# EAGLE design 3-Displays (EAGLE 7.2.0)
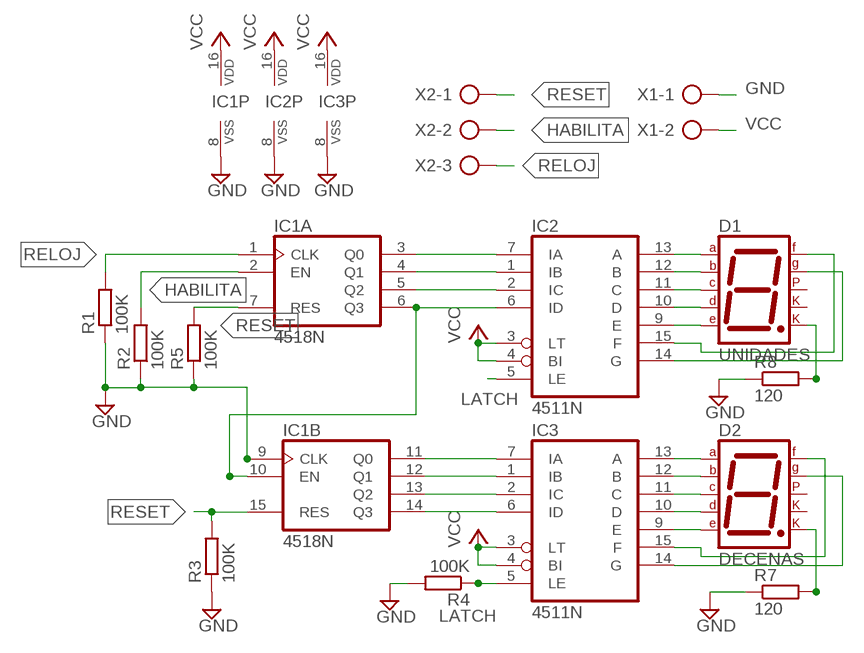
[diagram p0: schematic, sheet 1]

## Parts
D1  UNIDADES  7SEG-CK  [7SEG-13]
D2  DECENAS  7SEG-CK  [7SEG-13]
IC1  4518N  [DIL16]
IC2  4511N  [DIL16]
IC3  4511N  [DIL16]
R1  100K  R-EU_0207/7  [0207/7]
R2  100K  R-EU_0207/7  [0207/7]
R3  100K  R-EU_0207/7  [0207/7]
R4  100K  R-EU_0207/7  [0207/7]
R5  100K  R-EU_0207/7  [0207/7]
R7  120  R-EU_0207/7  [0207/7]
R8  120  R-EU_0207/7  [0207/7]
X1  AK500/2-H  [AK500/2-H]
X2  AK500/3-H  [AK500/3-H]

## Nets
GND: IC1.8(P:VSS) IC1.9(B:CLK) IC2.8(VSS) IC3.8(VSS) R1.1 R2.1 R3.1 R4.2 R5.1 R7.1 R8.1 X1.1
HABILITA: IC1.2(A:EN) R2.2 X2.2
LATCH: IC2.5(LE) IC3.5(LE) R4.1
N$1: IC1.3(A:Q0) IC2.7(IA)
N$2: IC1.4(A:Q1) IC2.1(IB)
N$3: IC1.5(A:Q2) IC2.2(IC)
N$4: D1.8(CK2) R8.2
N$5: D2.7(A) IC3.13(A)
N$6: D2.6(B) IC3.12(B)
N$7: D2.4(C) IC3.11(C)
N$8: D2.2(D) IC3.10(D)
N$9: D2.1(E) IC3.9(E)
N$10: IC1.11(B:Q0) IC3.7(IA)
N$11: IC1.12(B:Q1) IC3.1(IB)
N$12: IC1.14(B:Q3) IC3.6(ID)
N$13: IC1.13(B:Q2) IC3.2(IC)
N$14: D2.9(F) IC3.15(F)
N$15: D2.10(G) IC3.14(G)
N$16: D2.8(CK2) R7.2
N$18: D1.7(A) IC2.13(A)
N$19: D1.6(B) IC2.12(B)
N$20: D1.4(C) IC2.11(C)
N$21: D1.2(D) IC2.10(D)
N$22: D1.1(E) IC2.9(E)
N$23: D1.9(F) IC2.15(F)
N$24: D1.10(G) IC2.14(G)
N$26: IC1.6(A:Q3) IC1.10(B:EN) IC2.6(ID)
RELOJ: IC1.1(A:CLK) R1.2 X2.3
RESET: IC1.7(A:RES) IC1.15(B:RES) R3.2 R5.2 X2.1
VCC: IC1.16(P:VDD) IC2.3(LT) IC2.4(BI) IC2.16(VDD) IC3.3(LT) IC3.4(BI) IC3.16(VDD) X1.2
Unconnected: D1.3(CK1) D1.5(DP) D2.3(CK1) D2.5(DP)

## Library data of the parts
D1 D2 = special:7SEG-CK: 7-segment DISPLAY single cathode, 13 mm
IC1 = 45xx:4518: Dual BCD up COUNTER
IC2 IC3 = 45xx:4511: BCD to 7-segment LATCH/DECODER/DRIVER
R1-R5 R7 R8 = resistor:R-EU_: RESISTOR, European symbol
X1 = con-ptr500:AK500/2-H: CONNECTOR Aug. 2004 / PTR Meßtechnik: Die Bezeichnung der Serie AK505 wurde geändert. Es handelt sich hierbei um AK500 in horizontaler Ausführung.; OC_FARNELL: unknown; OC_NEWARK: unknown
X2 = con-ptr500:AK500/3-H: CONNECTOR Aug. 2004 / PTR Meßtechnik: Die Bezeichnung der Serie AK505 wurde geändert. Es handelt sich hierbei um AK500 in horizontaler Ausführung.; OC_FARNELL: unknown; OC_NEWARK: unknown

## Board
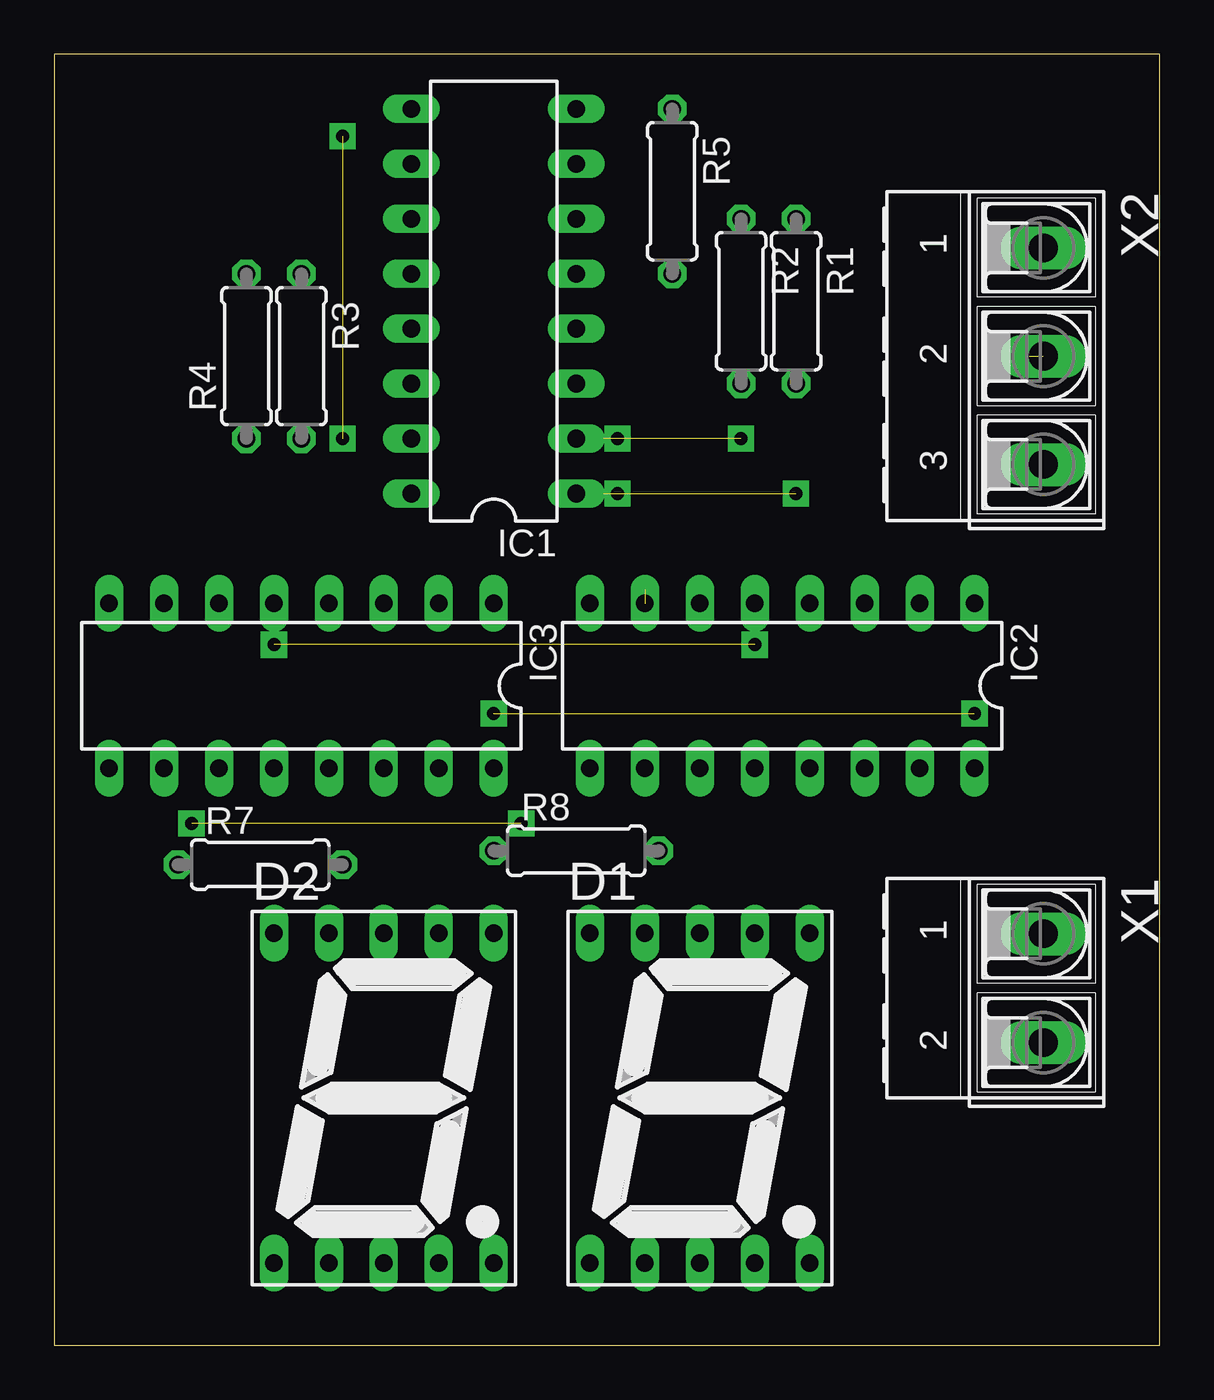
[diagram p1: board, top side]
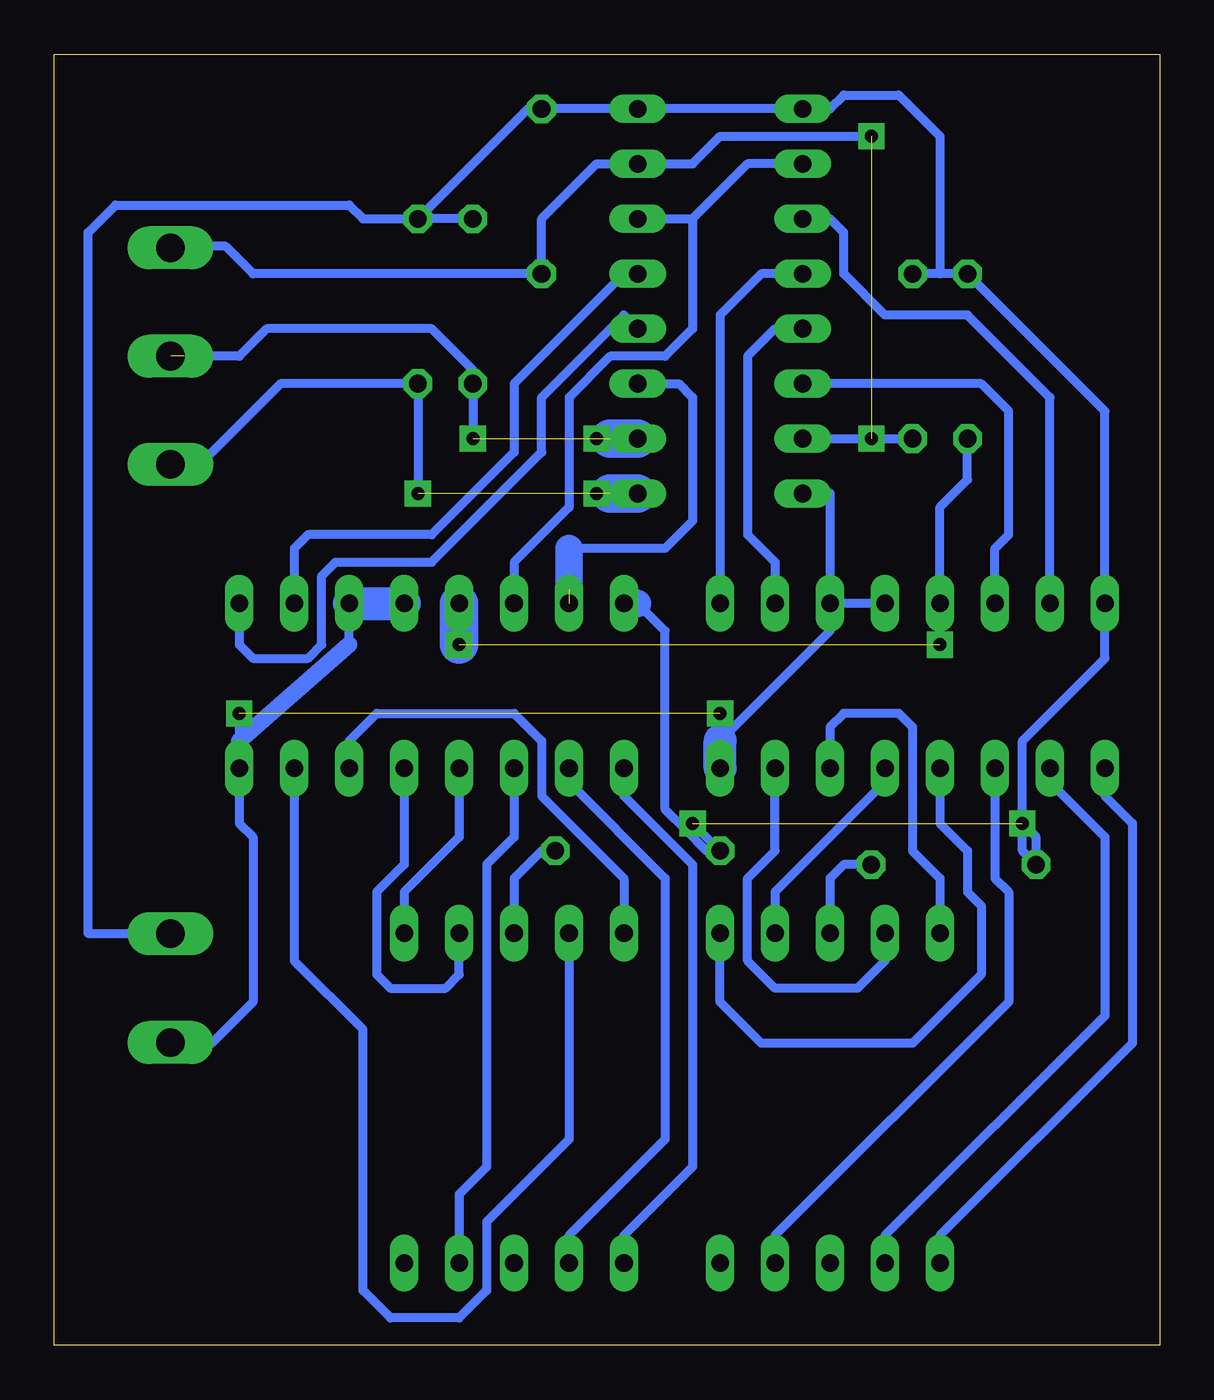
[diagram p2: board, bottom side, seen from below]

Size 51.1 x 59.68 mm. Coordinates in mm from the lower left corner, seen from the top.
Outline: 0,0 51.1,0 51.1,59.68 0,59.68 0,0
Copper layers (1*16): Top 0.035mm / dielectric 1.5mm / Bottom 0.035mm
Design rules "default *": minimum track width 10mil, minimum drill 24mil, track to track 8mil, track to pad 8mil, pad to pad 8mil, via to via 8mil, smd to smd 8mil, copper to edge 40mil, drill to drill 8mil, minimum pad ring 10mil, minimum via ring 12mil, stop-mask expansion 4mil, vias tented up to drill 0mil, thermal gap 10mil

### Footprints (pad centres in the part's own frame; a part is rotated, then mirrored left to right if it is on the bottom)
7SEG-13 = drill 0.813 long: 1 -5.08,-7.62; 2 -2.54,-7.62; 3 0,-7.62; 4 2.54,-7.62; 5 5.08,-7.62; 6 5.08,7.62; 7 2.54,7.62; 8 0,7.62; 9 -2.54,7.62; 10 -5.08,7.62
DIL16 = drill 0.813 long: 1 -8.89,-3.81; 2 -6.35,-3.81; 3 -3.81,-3.81; 4 -1.27,-3.81; 5 1.27,-3.81; 6 3.81,-3.81; 7 6.35,-3.81; 8 8.89,-3.81; 9 8.89,3.81; 10 6.35,3.81; 11 3.81,3.81; 12 1.27,3.81; 13 -1.27,3.81; 14 -3.81,3.81; 15 -6.35,3.81; 16 -8.89,3.81
0207/7 = drill 0.813 octagon: 1 -3.81,0; 2 3.81,0
AK500/2-H = drill 1.321 long: 1 -2.515,0; 2 2.515,0
AK500/3-H = drill 1.321 long: 1 -5.004,0; 2 0,0; 3 5.004,0

### Placement (x,y rotation side)
D1  29.84,11.43 0 top
D2  15.24,11.43 0 top
IC1  20.32,48.26 90 top
IC2  33.65,30.48 180 top
IC3  11.43,30.48 180 top
R1  34.29,48.26 270 top
R2  31.75,48.26 270 top
R3  11.43,45.72 270 top
R4  8.89,45.72 90 top
R5  28.57,53.34 270 top
R7  9.53,22.23 0 top
R8  24.13,22.86 0 top
X1  45.72,16.51 270 top
X2  45.72,45.72 270 top

### Tracks (layer width: path | path; a pad name or v marks a point on that pad's centre or on a via)
GND  (via drill 0.6)  (1 unrouted)
  Bottom 0.406: v6.35,24.13 5.71,23.5 R7.1 6.35,22.86 v6.35,24.13 | v6.35,24.13 6.35,27.94 2.54,31.75 IC3.8 2.54,43.18 R4.2 10.16,49.53 | R2.1 R1.1 | 21.91,23.81 20.96,22.86 R8.1 21.59,24.13 21.91,23.81 | 21.91,23.81 22.86,24.77 22.86,33.02 24.13,34.29 | 10.16,49.53 R3.1 | IC1.9 IC1.8 R5.1 | R5.1 29.21,57.15 R1.1 | IC1.9 R5.1 | X1.1 49.5,19.03 49.53,19.05 49.53,51.43 48.26,52.7 37.46,52.7 36.83,52.07 R1.1 | IC1.9 15.24,57.15 14.61,57.78 12.07,57.78 10.16,55.88 10.16,49.53
  Bottom 1.27: 24.13,34.29 IC2.8
HABILITA  (2 unrouted)
  Bottom 0.406: 45.08,45.72 42.54,45.72 41.27,46.99 33.65,46.99 31.75,45.08 R2.2 31.75,41.91
  Bottom 1.778: IC1.2 25.4,41.91
LATCH  (via drill 0.6)  (1 unrouted)
  Bottom 0.406: R4.1 8.89,40 10.16,38.73 IC3.5 v10.16,32.38
  Bottom 1.778: IC2.5 v32.38,32.38
N$1  (1 unrouted)
  Bottom 0.406: IC1.3 22.23,44.45 21.59,43.81 21.59,38.1 22.86,36.83 27.3,36.83
  Bottom 1.27: 27.3,36.83 27.3,34.92
N$2
  Bottom 0.406: IC2.1 42.54,32.38 41.91,31.75 39.37,31.75 38.73,32.38 38.73,35.56 38.1,36.2 33.65,36.2 28.57,41.27 28.57,43.81 24.77,47.62 IC1.4
N$3
  Bottom 0.406: IC1.5 24.77,49.53 29.84,44.45 29.84,41.27 33.65,37.46 39.37,37.46 40,36.83 IC2.2
N$4
  Bottom 0.406: R8.2 28.57,22.86 29.84,21.59 D1.8
N$5
  Bottom 0.406: IC3.13 12.7,26.04 17.78,20.96 D2.7
N$6
  Bottom 0.406: IC3.12 10.16,24.13 8.89,22.86 8.89,20.96 8.26,20.32 8.26,17.14 11.43,13.97 18.41,13.97 20.32,15.88 D2.6
N$7
  Bottom 0.406: D2.4 17.78,5.08 6.99,15.88 6.99,20.96 7.62,21.59 IC3.11
N$8
  Bottom 0.406: IC3.10 5.08,26.04 2.54,23.5 2.54,15.24 12.7,5.08 D2.2
N$9
  Bottom 0.406: IC3.9 2.54,25.4 1.27,24.13 1.27,13.97 10.16,5.08 D2.1
N$10
  Bottom 0.406: IC3.7 5.08,43.81 8.89,47.62 12.7,47.62 14.61,49.53 14.61,51.43 15.24,52.07 IC1.11
N$11
  Bottom 0.406: IC1.12 18.41,49.53 20.32,47.62 IC3.1
N$12
  Bottom 0.406: IC3.6 7.62,36.83 6.99,37.46 6.99,43.18 8.26,44.45 IC1.14
N$13
  Bottom 0.406: IC1.13 17.78,46.99 19.05,45.72 19.05,37.46 17.78,36.2 IC3.2
N$14
  Bottom 0.406: D2.9 12.7,17.78 13.97,16.51 17.78,16.51 19.05,17.78 19.05,21.59 17.78,22.86 IC3.15
N$15
  Bottom 0.406: IC3.14 15.24,28.57 14.61,29.21 12.07,29.21 11.43,28.57 11.43,22.86 10.16,21.59 D2.10
N$16
  Bottom 0.406: R7.2 14.61,22.23 15.24,21.59 D2.8
N$17  (via drill 0.6)
  other vias: 26.04,41.91
N$18
  Bottom 0.406: IC2.13 34.92,22.23 36.2,20.96 36.2,17.14 35.56,16.51 33.02,16.51 32.38,17.14 D1.7
N$19
  Bottom 0.406: IC2.12 32.38,23.5 34.92,20.96 D1.6
N$20
  Bottom 0.406: IC2.11 29.84,23.5 31.11,22.23 31.11,8.26 32.38,6.99 D1.4
N$21
  Bottom 0.406: IC2.10 27.3,26.04 22.86,21.59 22.86,9.53 27.3,5.08 D1.2
N$22
  Bottom 0.406: IC2.9 24.77,25.4 21.59,22.23 21.59,8.26 24.77,5.08 D1.1
N$23
  Bottom 0.406: IC2.15 40,17.78 36.83,14.61 36.83,2.54 35.56,1.27 32.38,1.27 31.11,2.54 31.11,5.71 27.3,9.53 D1.9
N$24
  Bottom 0.406: IC2.14 37.46,27.94 36.2,29.21 29.84,29.21 28.57,27.94 28.57,25.4 24.77,21.59 D1.10
N$25  (via drill 0.6)
  other vias: 26.04,39.37
N$26
  Bottom 0.406: IC1.10 19.05,54.61 21.59,52.07 | IC1.6 21.59,52.07 | 21.59,52.07 21.59,46.99 22.86,45.72 25.4,45.72 27.3,43.81 27.3,38.73 29.84,36.2 IC2.6
N$27  (via drill 0.6)
  other vias: 34.29,39.37
N$28  (via drill 0.6)
  other vias: 31.75,41.91
N$29  (via drill 0.6)
  other vias: 21.59,24.13
N$30  (via drill 0.6)
  other vias: 20.32,29.21
N$31  (via drill 0.6)
  other vias: 42.54,29.21
N$32  (via drill 0.6)
  other vias: 13.34,41.91
N$33  (via drill 0.6)
  other vias: 13.34,55.88
RELOJ  (1 unrouted)
  Bottom 0.406: X2.3 45.64,40.64 44.45,40.64 40.64,44.45 R1.2 34.29,39.37
  Bottom 1.778: IC1.1 25.4,39.37
RESET  (1 unrouted)
  Bottom 0.406: IC1.15 R3.2 | X2.1 45.64,50.8 43.18,50.8 41.91,49.53 R5.2 28.57,52.07 26.04,54.61 IC1.7 21.59,54.61 20.32,55.88 13.34,55.88
VCC  (1 unrouted)
  Bottom 0.406: IC1.16 15.24,39.37 IC3.3 | IC3.4 IC3.3 | IC3.3 15.24,33.02 20.32,27.94 20.32,29.21 | 37.46,32.38 IC2.3 | X1.2 45.7,13.97 43.81,13.97 41.91,15.88 41.91,23.5 42.54,24.13 IC2.16 42.54,27.94 42.54,29.21
  Bottom 0.762: 42.54,27.94 37.46,32.38
  Bottom 1.524: IC2.3 IC2.4 | IC3.16 20.32,27.94